# Altium schematic sheet Fish and Microchips Schematic.SchDoc
size A3; SheetNumber: 1; SheetTotal: 1
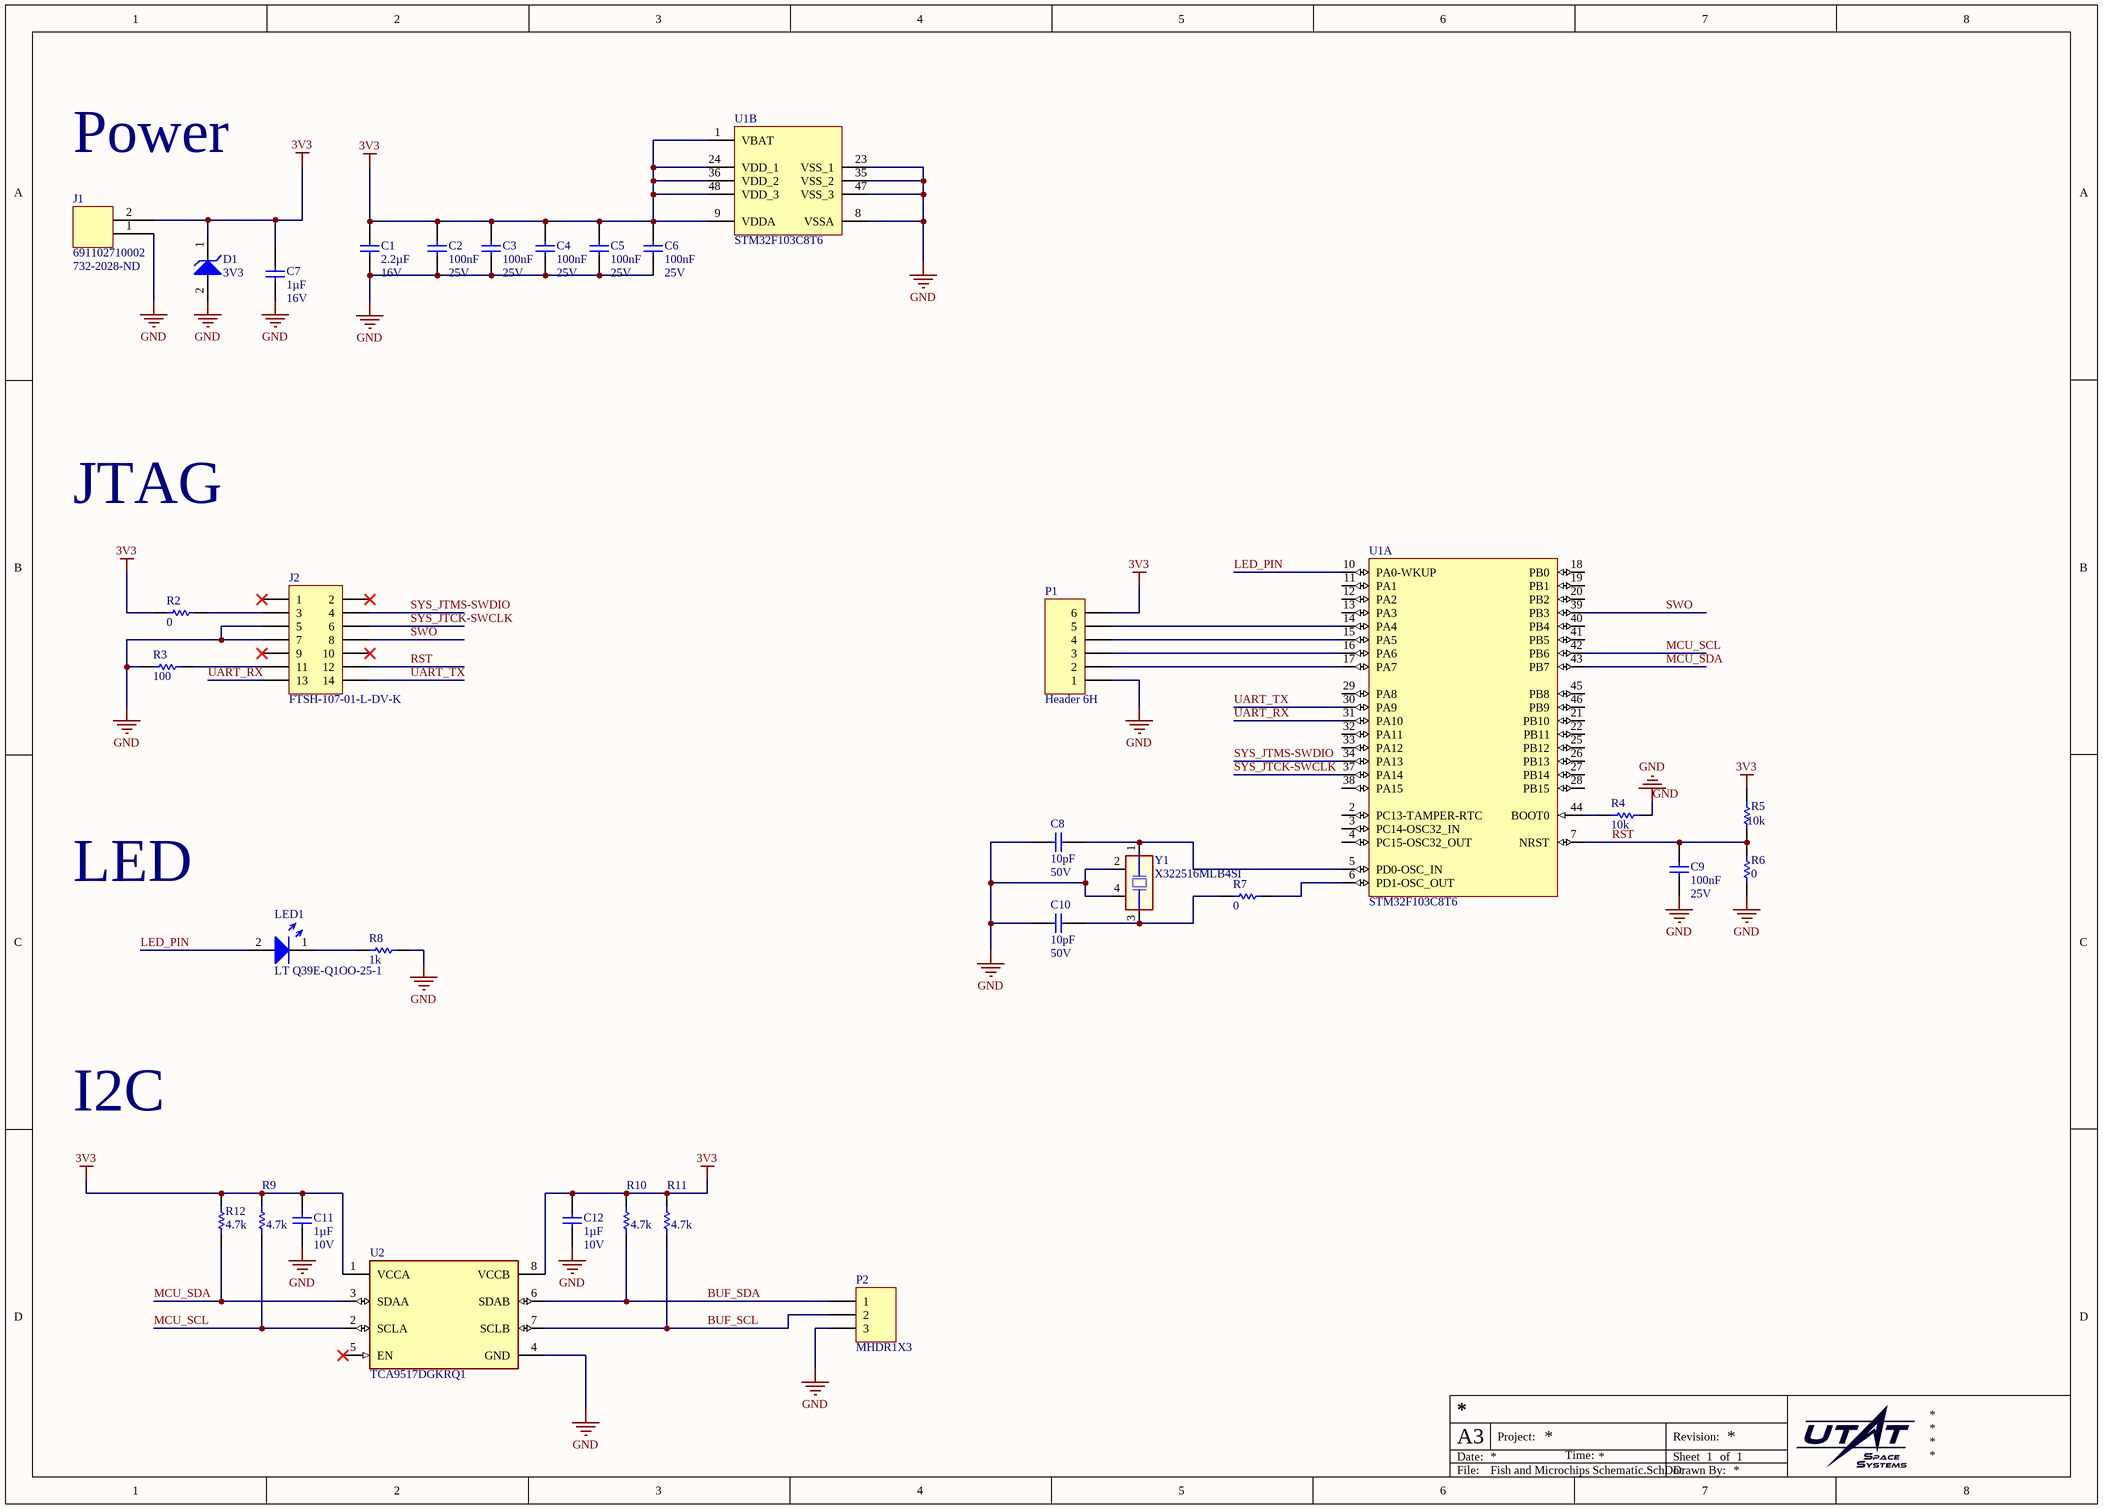
[diagram p0: Fish and Microchips Schematic.SchDoc]

## Parts
C1  value 2.2µF  Voltage Rating: 16V  [CAP0805R]  (hidden comment: GCM21BR71C225KA64L)
C2  value 100nF  Voltage Rating: 25V  [CAP0603R]  (hidden comment: CGA3E2X7R1E104K080AA)
C3  value 100nF  Voltage Rating: 25V  [CAP0603R]  (hidden comment: CGA3E2X7R1E104K080AA)
C4  value 100nF  Voltage Rating: 25V  [CAP0603R]  (hidden comment: CGA3E2X7R1E104K080AA)
C5  value 100nF  Voltage Rating: 25V  [CAP0603R]  (hidden comment: CGA3E2X7R1E104K080AA)
C6  value 100nF  Voltage Rating: 25V  [CAP0603R]  (hidden comment: CGA3E2X7R1E104K080AA)
C7  value 1µF  Voltage Rating: 16V  [CAP0805R]  (hidden comment: GCM21BR71C105KA58L)
C8  value 10pF  Voltage Rating: 50V  [CAP0402R]  (hidden comment: GCQ1555C1H100JB01D)
C9  value 100nF  Voltage Rating: 25V  [CAP0603R]  (hidden comment: CGA3E2X7R1E104K080AA)
C10  value 10pF  Voltage Rating: 50V  [CAP0402R]  (hidden comment: GCQ1555C1H100JB01D)
C11  value 1µF  Voltage Rating: 10V  [CAP0805R]  (hidden comment: LMK212B7105KGHTR)
C12  value 1µF  Voltage Rating: 10V  [CAP0805R]  (hidden comment: LMK212B7105KGHTR)
D1  3V3  [ONSC-SOD-323-2-477-02_V]
J1  691102710002  Supplier Part Number 1: 732-2028-ND  [CON2_SCREW_5.00MM_691102710002]
J2  FTSH-107-01-L-DV-K  [FP-FTSH-107-01-L-DV-K-MFG]
LED1  LT Q39E-Q1OO-25-1  [LED0603]
P1  Header 6H  [HDR1X6H]
P2  MHDR1X3  [MHDR1X3]
R2  value 0  [RES0805R]  (hidden comment: ERJ-6GEY0R00V)
R3  value 100  [RES0603R]  (hidden comment: ERJ-3GEYJ101V)
R4  value 10k  [RES0603R]  (hidden comment: ERJ-3GEYJ103V)
R5  value 10k  [RES0603R]  (hidden comment: ERJ-3GEYJ103V)
R6  value 0  [RES0805R]  (hidden comment: ERJ-6GEY0R00V)
R7  value 0  [RES0805R]  (hidden comment: ERJ-6GEY0R00V)
R8  value 1k  [RES0805R]  (hidden comment: CRCW08051K00FKTC)
R9  value 4.7k  [RES0402R]  (hidden comment: ERJ-2GEJ472X)
R10  value 4.7k  [RES0402R]  (hidden comment: ERJ-2GEJ472X)
R11  value 4.7k  [RES0402R]  (hidden comment: ERJ-2GEJ472X)
R12  value 4.7k  [RES0402R]  (hidden comment: ERJ-2GEJ472X)
U1  STM32F103C8T6  [STM-LQFP48_M]  (parts A,B of 2)
U2  TCA9517DGKRQ1  [FP-DGK0008A-MFG]
Y1  X322516MLB4SI  [X322516MLB4SI-Footprint-1]

## Nets
3V3: C1.2 C2.2 C3.2 C4.2 C5.2 C6.2 C7.2 C11.2 C12.2 D1.1(K) J1.2 P1.6 R2.1 R5.2 R9.2 R10.2 R11.2 R12.2 U1.1(VBAT) U1.9(VDDA) U1.24(VDD_1) U1.36(VDD_2) U1.48(VDD_3) U2.1(VCCA) U2.8(VCCB)
GND: C1.1 C2.1 C3.1 C4.1 C5.1 C6.1 C7.1 C8.2 C9.1 C10.1 C11.1 C12.1 D1.2(A) J1.1 J2.5 J2.7 P1.1 P2.3 R3.1 R4.2 R6.1 R8.2 U1.8(VSSA) U1.23(VSS_1) U1.35(VSS_2) U1.47(VSS_3) U2.4(GND) Y1.2(GND) Y1.4(GND)
BUF_SCL: P2.2 R11.1 U2.7(SCLB)
BUF_SDA: P2.1 R10.1 U2.6(SDAB)
LED_PIN: LED1.2(Anode) U1.10(PA0-WKUP)
MCU_SCL: R9.1 U1.42(PB6) U2.2(SCLA)
MCU_SDA: R12.1 U1.43(PB7) U2.3(SDAA)
RST: C9.2 J2.12 R5.1 R6.2 U1.7(NRST)
SWO: J2.8 U1.39(PB3)
SYS_JTCK-SWCLK: J2.6 U1.37(PA14)
SYS_JTMS-SWDIO: J2.4 U1.34(PA13)
UART_RX: J2.13 U1.31(PA10)
UART_TX: J2.14 U1.30(PA9)
NetC8_1: C8.1 U1.5(PD0-OSC_IN) Y1.1(OSC1)
NetC10_2: C10.2 R7.1 Y1.3(OSC2)
NetJ2_3: J2.3 R2.2
NetJ2_11: J2.11 R3.2
NetLED1_1: LED1.1(Cathode) R8.1
NetP1_2: P1.2 U1.17(PA7)
NetP1_3: P1.3 U1.16(PA6)
NetP1_4: P1.4 U1.15(PA5)
NetP1_5: P1.5 U1.14(PA4)
NetR4_1: R4.1 U1.44(BOOT0)
NetR7_2: R7.2 U1.6(PD1-OSC_OUT)

Not connected (* = marked no-connect by the designer): J2 1* 2* 9* 10*; U1 2(PC13-TAMPER-RTC) 3(PC14-OSC32_IN) 4(PC15-OSC32_OUT) 11(PA1) 12(PA2) 13(PA3) 18(PB0) 19(PB1) 20(PB2) 21(PB10) 22(PB11) 25(PB12) 26(PB13) 27(PB14) 28(PB15) 29(PA8) 32(PA11) 33(PA12) 38(PA15) 40(PB4) 41(PB5) 45(PB8) 46(PB9); U2 5(EN)*

## Notes on the sheet
- (near J1) Power
- JTAG
- LED
- I2C
- Date:
- A3
- Project:
- Time:
- Revision:
- Sheet
- of
- File:
- Drawn By:

## Library data of the parts
C1 = CMP-024-000719-8: CAP CER 2.2UF 16V X7R 0805; Manufacturer: Murata Electronics; Tolerance: 10%; Supplier 1: Digi-Key; Max Operating Temperature: 125°C; Supplier Part Number 1: 490-4786-1-ND; ComponentLink1URL: https://psearch.en.murata.com/capacitor/product/GCM21BR71C225KA64%23.pdf; Temperature Coefficient: X7R; Case/Package: 0805 (2012 Metric); Rating: AEC-Q200; PN: GCM21BR71C225KA64L; Min Operating Temperature: -55°C; ComponentLink1Description: Datasheet
C2-C6 C9 = CMP-024-000155-8: CAP CER 0.1UF 25V X7R 0603; Manufacturer: TDK Corporation; Tolerance: 10%; Temperature Coefficient: X7R; Supplier 1: Digi-Key; PN: CGA3E2X7R1E104K080AA; ComponentLink1Description: Datasheet; Max Operating Temperature: 125°C; Case/Package: 0603 (1608 Metric); Min Operating Temperature: -55°C; Supplier Part Number 1: 445-5667-1-ND; ComponentLink1URL: https://product.tdk.com/info/en/catalog/datasheets/mlcc_automotive_general_en.pdf?ref_disty=digikey; Rating: AEC-Q200
C7 = CMP-024-000717-8: CAP CER 1UF 16V X7R 0805; Manufacturer: Murata Electronics; Tolerance: 10%; Max Operating Temperature: 125°C; Supplier 1: Digi-Key; ComponentLink1URL: https://search.murata.co.jp/Ceramy/image/img/A01X/G101/ENG/GCM21BR71C105KA58-01.pdf; Min Operating Temperature: -55°C; ComponentLink1Description: Datasheet; PN: GCM21BR71C105KA58L; Supplier Part Number 1: 490-14437-1-ND; Temperature Coefficient: X7R; Rating: AEC-Q200; Case/Package: 0805 (2012 Metric)
C8 C10 = CMP-024-000761-8: CAP CER 10PF 50V C0G/NP0 0402; Manufacturer: Murata Electronics; Temperature Coefficient: C0G, NP0; Tolerance: 5%; PN: GCQ1555C1H100JB01D; Case/Package: 0402 (1005 Metric); Min Operating Temperature: -55°C; ComponentLink1Description: Datasheet; Supplier 1: Digi-Key; ComponentLink1URL: https://search.murata.co.jp/Ceramy/image/img/A01X/G101/ENG/GCQ1555C1H100JB01-01.pdf; Supplier Part Number 1: 490-17423-1-ND; Rating: AEC-Q200; Max Operating Temperature: 125°C
C11 C12 = CMP-024-001219-8: CAP CER 1UF 10V X7R 0805; Manufacturer: Taiyo Yuden; Tolerance: 10%; ComponentLink1URL: https://www.yuden.co.jp/productdata/catalog/mlcc_all_hq_e.pdf; Temperature Coefficient: X7R; PN: LMK212B7105KGHTR; Case/Package: 0805 (2012 Metric); Min Operating Temperature: -55°C; Rating: AEC-Q200; Supplier Part Number 1: 587-6338-1-ND; Max Operating Temperature: 125°C; Supplier 1: Digi-Key; ComponentLink1Description: Datasheet
D1 = CMP-004-00015-1: Zener Diode, 3.3V V(Z), 6%, 0.3W, Silicon, Unidirectional; Max Operating Temperature: 150°C; RoHS Compliant: Yes
J1 = CMP-027-000000-1: 2 Position Wire to Board Terminal Block Horizontal with Board 0.197" (5.00mm) Through Hole; Manufacturer: Würth Elektronik; Connector Type: Screw Terminal; Number of Positions: 2; Pitch - Mating: 0.197" (5.00mm); ComponentLink1URL: https://www.we-online.de/katalog/datasheet/6911027100xx.pdf; ComponentLink1Description: Datasheet; Supplier 1: Digi-Key; Series: WR-TBL Series 102; PN: 691102710002; Number of Rows: 1; Contact Type: Wire
J2 = CMP-002-00034-3: Conn Unshrouded Header HDR 14 POS 1.27mm Solder ST Top Entry SMD TIGER CLAW™ Tube; Current Rating: 3.4A; Number of Contacts: 14; Gender: Male; Pitch: 1.27mm; Number of Rows: 2; Min Operating Temperature: -55°C; Contact Material: Bronze; Max Operating Temperature: 125°C
LED1 = CMP-029-000017-3: LED GREEN DIFFUSED 0603 SMD; Manufacturer: OSRAM Opto Semiconductors Inc.; Current - Average: 5mA; Voltage - Forward Max: 2.85V; Package: 0603 (1608 Metric); Supplier 1: Digi-Key; PN: LT Q39E-Q1OO-25-1; ComponentLink1URL: https://dammedia.osram.info/media/resource/hires/osram-dam-2493475/LT%20Q39E.pdf; ComponentLink1Description: Datasheet; Type: LED; Supplier Part Number 1: 475-3441-1-ND; Color: Green
P1 = CMP-083-000108-1: Header, 6-Pin, Right Angle; Signal Integrity: Connector; Component Type: Standard; Source: Miscellaneous Connectors.SchLib; Pin Count: 6; LatestRevisionDate: 17-Jul-2002; Publisher: Altium Limited; Design Item ID: Header 6H; LatestRevisionNote: Re-released for DXP Platform.
P2 = CMP-083-000139-1: Header, 3-Pin; Signal Integrity: Connector; Source: Miscellaneous Connectors.SchLib; Design Item ID: MHDR1X3; Pin Count: 3; Publisher: Altium Limited; LatestRevisionNote: Re-released for DXP Platform.; LatestRevisionDate: 17-Jul-2002; Component Type: Standard
R2 R6 R7 = CMP-054-002879-6: RES SMD 0 OHM JUMPER 1/8W 0805; Manufacturer: Panasonic; Power: 125mW; Tolerance: 0%; PN: ERJ-6GEY0R00V; Composition: Thick Film; Case/Package: 0805 (2012 Metric); Min Operating Temperature: -55°C; Rating: AEC-Q200; Supplier 1: Digi-Key; ComponentLink1URL: http://industrial.panasonic.com/www-cgi/jvcr13pz.cgi?E+PZ+3+AOA0001+ERJ6GEY0R00V+7+WW; Supplier Part Number 1: P0.0ACT-ND; Max Operating Temperature: 155°C; ComponentLink1Description: Datasheet
R3 = CMP-054-002817-6: RES SMD 100 OHM 5% 1/10W 0603; Manufacturer: Panasonic; Power: 100mW; Min Operating Temperature: -55°C; Max Operating Temperature: 155°C; Rating: AEC-Q200; PN: ERJ-3GEYJ101V; ComponentLink1Description: Datasheet; Tolerance: 5%; Supplier Part Number 1: P100GCT-ND; Supplier 1: Digi-Key; Case/Package: 0603 (1608 Metric); ComponentLink1URL: http://industrial.panasonic.com/www-cgi/jvcr13pz.cgi?E+PZ+3+AOA0001+ERJ3GEYJ101V+7+WW; Composition: Thick Film
R4 R5 = CMP-054-002819-6: RES SMD 10K OHM 5% 1/10W 0603; Manufacturer: Panasonic; Power: 100mW; ComponentLink1URL: http://industrial.panasonic.com/www-cgi/jvcr13pz.cgi?E+PZ+3+AOA0001+ERJ3GEYJ103V+7+WW; Rating: AEC-Q200; Max Operating Temperature: 155°C; Min Operating Temperature: -55°C; Tolerance: 5%; Supplier Part Number 1: P10KGCT-ND; PN: ERJ-3GEYJ103V; Case/Package: 0603 (1608 Metric); ComponentLink1Description: Datasheet; Composition: Thick Film; Supplier 1: Digi-Key
R8 = CMP-054-001714-6: RES SMD 1K OHM 1% 1/8W 0805; Manufacturer: Vishay Dale; Power: 125mW; PN: CRCW08051K00FKTC; Rating: AEC-Q200; Max Operating Temperature: 155°C; Supplier Part Number 1: 541-4320-1-ND; Tolerance: 1%; Min Operating Temperature: -55°C; ComponentLink1URL: https://www.vishay.com/docs/20008/dcrcw.pdf; Supplier 1: Digi-Key; ComponentLink1Description: Datasheet; Case/Package: 0805 (2012 Metric); Composition: Thick Film
R9-R12 = CMP-054-002447-6: RES SMD 4.7K OHM 5% 1/10W 0402; Manufacturer: Panasonic; Power: 100mW; Case/Package: 0402 (1005 Metric); Min Operating Temperature: -55°C; ComponentLink1URL: https://b2b-api.panasonic.eu/file_stream/pids/fileversion/1242; Tolerance: 5%; Composition: Thick Film; Max Operating Temperature: 155°C; Supplier 1: Digi-Key; PN: ERJ-2GEJ472X; ComponentLink1Description: Datasheet; Rating: AEC-Q200; Supplier Part Number 1: P4.7KJCT-ND
U1 = CMP-00007-1: RISC Microcontroller, 32-Bit, FLASH, STM32 CPU, 72MHz, CMOS, PQFP48; Number of I/O Lines: 37; Qualification Status: Not Qualified; Interface: I2C,SPI,USB,CAN,USART; Peripherals: POR,DMA; Package Equivalence Code: QFP48,.35SQ,20; Max Supply Voltage: 3.6V; Min Supply Voltage: 2V; Package Body Material: Plastic; Time @ Peak Reflow Temperature-Max (s): 30s; Max Supply Current: 50mA; Power Supplies: 2.5/3.3; Clock Frequency: 16MHz; Nominal Supply Voltage: 3.3V; JESD-609 Code: e4; Peak Reflow Temperature (Cel): 260°C; Package Shape: Square; Width: 7mm; Moisture Sensitivity Level: 2; Terminal Form: Gull Wing; Technology: CMOS; Terminal Position: QUAD; Terminal Finish: Nickel; Max Operating Temperature: 105°C; RoHS Compliant: Yes; Pins: 48; Length: 7mm; Temperature Grade: INDUSTRIAL; Surface Mount: Yes; Case/Package: LFQFP; Reach SVHC Compliant: Yes; Terminal Pitch: 0.5mm; JESD-30 Code: S-PQFP-G48; Min Operating Temperature: -40°C; Height - Seated (Max): 1.6mm
U2 = CMP-015-00008-5: Voltage Level Translator Bidirectional 1 Circuit 2 Channel 8-VSSOP; Frequency: 400kHz; Max Operating Temperature: 125°C; Case/Package: VSSOP; Min Operating Temperature: -40°C; Channel Type: Bidirectional
Y1 = CMP-003-00003-2: 16MHz Surface Mount Crystal 9pF ±10ppm ±20ppm SMD3225-4P Crystals ROHS; Frequency: 16MHz